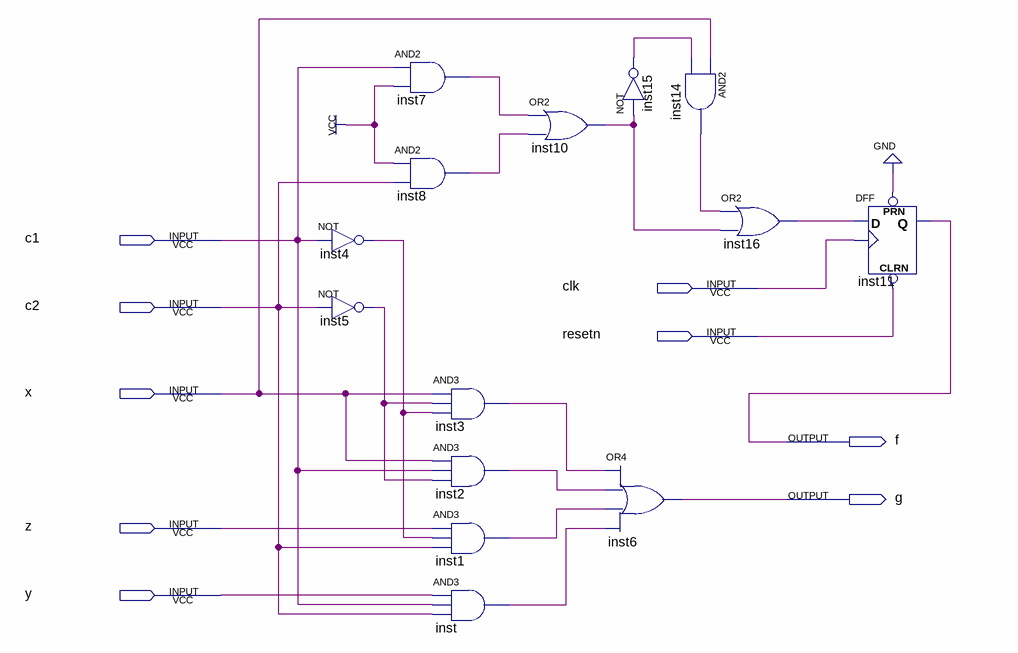
[diagram p0: schematic sheet]
// Quartus schematic Questao03.bdf as structural Verilog: 14 symbols, 9 pins
module Questao03 (
  input  c1,
  input  clk,
  input  c2,
  input  resetn,
  input  x,
  input  z,
  input  y,
  output f,
  output g
);

  wire inst1_out, inst2_out, inst3_out, inst4_out, inst5_out, inst7_out, inst8_out, inst10_out, inst14_out,
       inst15_out, inst16_out, inst_out;

  not inst4 (inst4_out, c1);
  not inst5 (inst5_out, c2);
  and inst7 (inst7_out, c1, 1'b1);
  and inst8 (inst8_out, 1'b1, c2);
  and inst3 (inst3_out, x, inst5_out, inst4_out);
  and inst2 (inst2_out, x, c1, inst5_out);
  and inst1 (inst1_out, z, inst4_out, c2);
  and inst (inst_out, y, c1, c2);
  or inst10 (inst10_out, inst7_out, inst8_out);
  or inst6 (g, inst3_out, inst2_out, inst1_out, inst_out);
  not inst15 (inst15_out, inst10_out);
  and inst14 (inst14_out, x, inst15_out);
  or inst16 (inst16_out, inst14_out, inst10_out);
  DFF inst11 (.CLRN(resetn), .CLK(clk), .D(inst16_out), .PRN(1'b0), .Q(f));
endmodule
